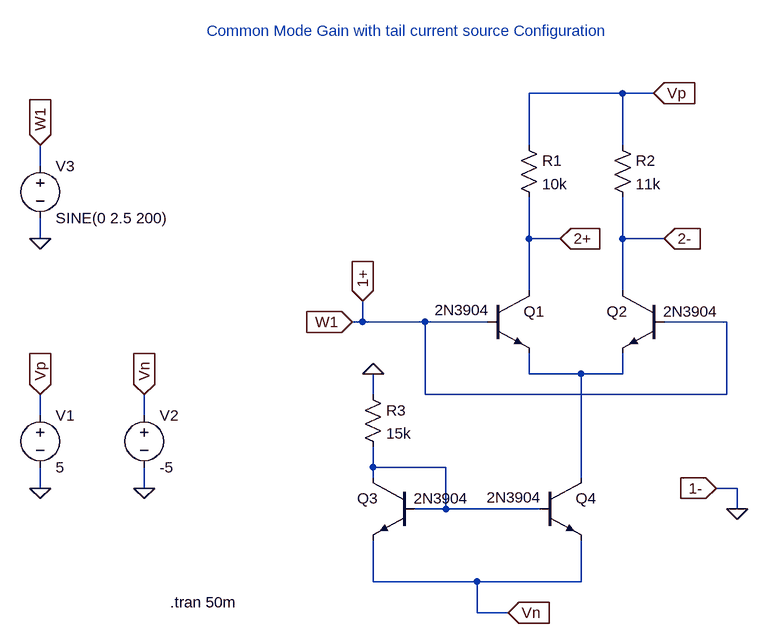
[diagram p0: schematic common_mode_tail_mirror.asc]
common_mode_tail_mirror.asc, the LTspice schematic file:
Version 4
SHEET 1 880 680
WIRE 448 -208 304 -208
WIRE 496 -208 448 -208
WIRE 304 -128 304 -208
WIRE 448 -128 448 -208
WIRE -448 -96 -448 -128
WIRE -448 16 -448 -16
WIRE 304 16 304 -48
WIRE 352 16 304 16
WIRE 448 16 448 -48
WIRE 512 16 448 16
WIRE 304 96 304 16
WIRE 448 96 448 16
WIRE 48 144 48 112
WIRE 48 144 32 144
WIRE 144 144 48 144
WIRE 240 144 144 144
WIRE 608 144 512 144
WIRE 304 224 304 192
WIRE 384 224 304 224
WIRE 448 224 448 192
WIRE 448 224 384 224
WIRE 64 256 64 224
WIRE 144 256 144 144
WIRE 608 256 608 144
WIRE 608 256 144 256
WIRE -448 288 -448 256
WIRE -288 288 -288 256
WIRE 64 368 64 336
WIRE 176 368 64 368
WIRE 64 384 64 368
WIRE 384 384 384 224
WIRE -448 400 -448 368
WIRE -288 400 -288 368
WIRE 624 400 592 400
WIRE 176 432 176 368
WIRE 176 432 128 432
WIRE 320 432 176 432
WIRE 624 432 624 400
WIRE 64 544 64 480
WIRE 224 544 64 544
WIRE 384 544 384 480
WIRE 384 544 224 544
WIRE 224 592 224 544
WIRE 272 592 224 592
FLAG 32 144 W1
IOPIN 32 144 In
FLAG 272 592 Vn
IOPIN 272 592 In
FLAG 496 -208 Vp
IOPIN 496 -208 In
FLAG -448 400 0
FLAG -288 400 0
FLAG -448 16 0
FLAG -448 256 Vp
IOPIN -448 256 In
FLAG -288 256 Vn
IOPIN -288 256 In
FLAG -448 -128 W1
IOPIN -448 -128 In
FLAG 48 112 1+
IOPIN 48 112 In
FLAG 352 16 2+
IOPIN 352 16 In
FLAG 512 16 2-
IOPIN 512 16 In
FLAG 64 224 0
FLAG 624 432 0
FLAG 592 400 1-
IOPIN 592 400 In
SYMBOL npn 240 96 R0
WINDOW 3 -81 30 Left 2
SYMATTR Value 2N3904
SYMATTR InstName Q1
SYMBOL npn 512 96 M0
WINDOW 3 -83 32 Left 2
SYMATTR Value 2N3904
SYMATTR InstName Q2
SYMBOL res 288 -144 R0
SYMATTR InstName R1
SYMATTR Value 10k
SYMBOL res 432 -144 R0
SYMATTR InstName R2
SYMATTR Value 11k
SYMBOL voltage -448 272 R0
WINDOW 123 0 0 Left 0
WINDOW 39 0 0 Left 0
SYMATTR InstName V1
SYMATTR Value 5
SYMBOL voltage -288 272 R0
WINDOW 123 0 0 Left 0
WINDOW 39 0 0 Left 0
SYMATTR InstName V2
SYMATTR Value -5
SYMBOL voltage -448 -112 R0
WINDOW 123 0 0 Left 0
WINDOW 39 0 0 Left 0
SYMATTR InstName V3
SYMATTR Value SINE(0 2.5 200)
SYMBOL npn 320 384 R0
WINDOW 3 -81 30 Left 2
SYMATTR Value 2N3904
SYMATTR InstName Q4
SYMBOL npn 128 384 M0
WINDOW 3 -83 32 Left 2
SYMATTR Value 2N3904
SYMATTR InstName Q3
SYMBOL res 48 240 R0
SYMATTR InstName R3
SYMATTR Value 15k
TEXT -248 576 Left 2 !.tran 50m
TEXT -192 -304 Left 2 ;Common Mode Gain with tail current source Configuration

The netlist it stands for:
* common_mode_tail_mirror.asc
Q1 2+ 1+ N001 0 2N3904
Q2 2- 1+ N001 0 2N3904
R1 Vp 2+ 10k
R2 Vp 2- 11k
V1 Vp 0 5
V2 Vn 0 -5
V3 1+ 0 SINE(0 2.5 200)
Q4 N001 N002 Vn 0 2N3904
Q3 N002 N002 Vn 0 2N3904
R3 0 N002 15k
.model NPN NPN
.model PNP PNP
.lib standard.bjt
.tran 50m
* Common Mode Gain with tail current source Configuration
.backanno
.end